# Altium schematic sheet GND.SchDoc
size A4
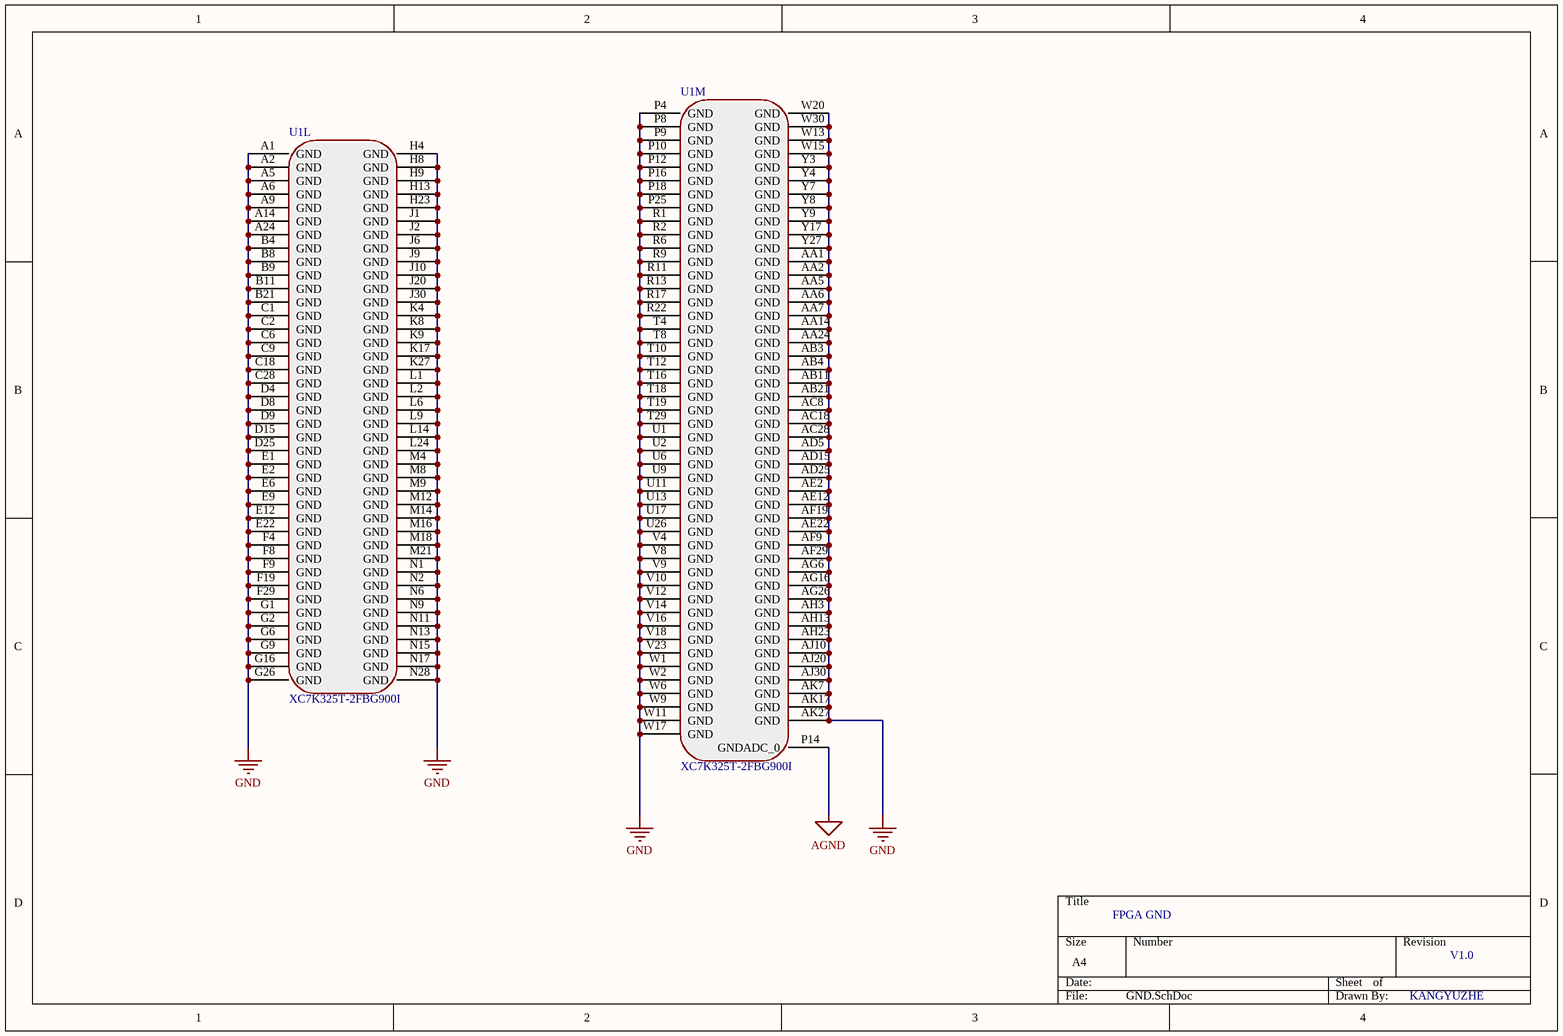
[diagram p0: GND.SchDoc]

## Parts
U1  XC7K325T-2FBG900I  [FBG900]  (parts L,M of 17)

## Nets
AGND: U1.P14(GNDADC_0)
GND: U1.A1(GND) U1.A2(GND) U1.A5(GND) U1.A6(GND) U1.A9(GND) U1.A14(GND) U1.A24(GND) U1.AA1(GND) U1.AA2(GND) U1.AA5(GND) U1.AA6(GND) U1.AA7(GND) U1.AA14(GND) U1.AA24(GND) U1.AB3(GND) U1.AB4(GND) U1.AB11(GND) U1.AB21(GND) U1.AC8(GND) U1.AC18(GND) U1.AC28(GND) U1.AD5(GND) U1.AD15(GND) U1.AD25(GND) U1.AE2(GND) U1.AE12(GND) U1.AE22(GND) U1.AF9(GND) U1.AF19(GND) U1.AF29(GND) U1.AG6(GND) U1.AG16(GND) U1.AG26(GND) U1.AH3(GND) U1.AH13(GND) U1.AH23(GND) U1.AJ10(GND) U1.AJ20(GND) U1.AJ30(GND) U1.AK7(GND) U1.AK17(GND) U1.AK27(GND) U1.B4(GND) U1.B8(GND) U1.B9(GND) U1.B11(GND) U1.B21(GND) U1.C1(GND) U1.C2(GND) U1.C6(GND) U1.C9(GND) U1.C18(GND) U1.C28(GND) U1.D4(GND) U1.D8(GND) U1.D9(GND) U1.D15(GND) U1.D25(GND) U1.E1(GND) U1.E2(GND) U1.E6(GND) U1.E9(GND) U1.E12(GND) U1.E22(GND) U1.F4(GND) U1.F8(GND) U1.F9(GND) U1.F19(GND) U1.F29(GND) U1.G1(GND) U1.G2(GND) U1.G6(GND) U1.G9(GND) U1.G16(GND) U1.G26(GND) U1.H4(GND) U1.H8(GND) U1.H9(GND) U1.H13(GND) U1.H23(GND) U1.J1(GND) U1.J2(GND) U1.J6(GND) U1.J9(GND) U1.J10(GND) U1.J20(GND) U1.J30(GND) U1.K4(GND) U1.K8(GND) U1.K9(GND) U1.K17(GND) U1.K27(GND) U1.L1(GND) U1.L2(GND) U1.L6(GND) U1.L9(GND) U1.L14(GND) U1.L24(GND) U1.M4(GND) U1.M8(GND) U1.M9(GND) U1.M12(GND) U1.M14(GND) U1.M16(GND) U1.M18(GND) U1.M21(GND) U1.N1(GND) U1.N2(GND) U1.N6(GND) U1.N9(GND) U1.N11(GND) U1.N13(GND) U1.N15(GND) U1.N17(GND) U1.N28(GND) U1.P4(GND) U1.P8(GND) U1.P9(GND) U1.P10(GND) U1.P12(GND) U1.P16(GND) U1.P18(GND) U1.P25(GND) U1.R1(GND) U1.R2(GND) U1.R6(GND) U1.R9(GND) U1.R11(GND) U1.R13(GND) U1.R17(GND) U1.R22(GND) U1.T4(GND) U1.T8(GND) U1.T10(GND) U1.T12(GND) U1.T16(GND) U1.T18(GND) U1.T19(GND) U1.T29(GND) U1.U1(GND) U1.U2(GND) U1.U6(GND) U1.U9(GND) U1.U11(GND) U1.U13(GND) U1.U17(GND) U1.U26(GND) U1.V4(GND) U1.V8(GND) U1.V9(GND) U1.V10(GND) U1.V12(GND) U1.V14(GND) U1.V16(GND) U1.V18(GND) U1.V23(GND) U1.W1(GND) U1.W2(GND) U1.W6(GND) U1.W9(GND) U1.W11(GND) U1.W13(GND) U1.W15(GND) U1.W17(GND) U1.W20(GND) U1.W30(GND) U1.Y3(GND) U1.Y4(GND) U1.Y7(GND) U1.Y8(GND) U1.Y9(GND) U1.Y17(GND) U1.Y27(GND)

## Notes on the sheet
- FPGA GND
- V1.0
- KANGYUZHE